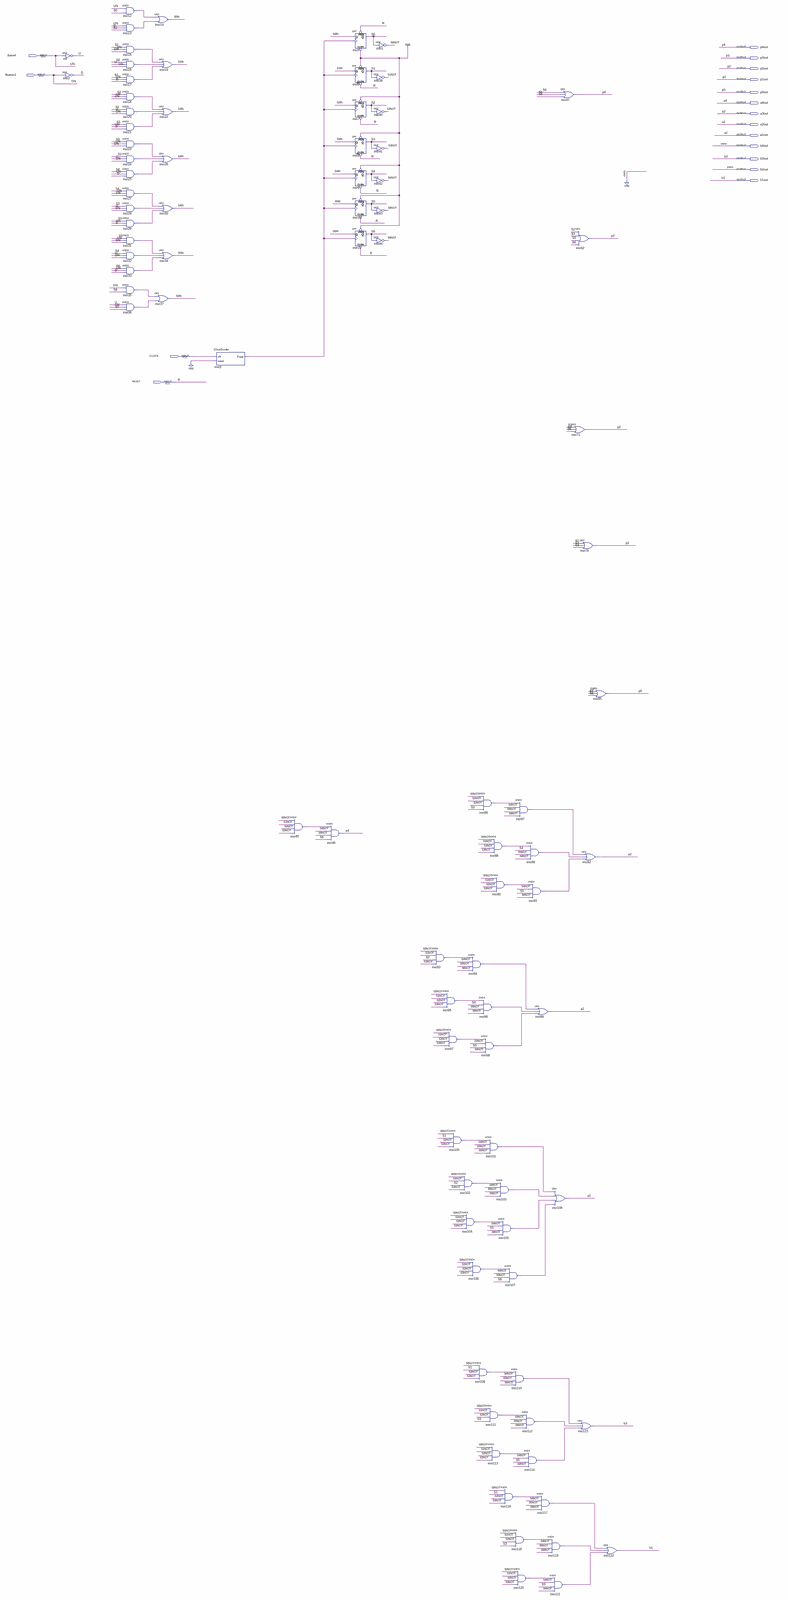
[diagram p0: schematic sheet, whole]
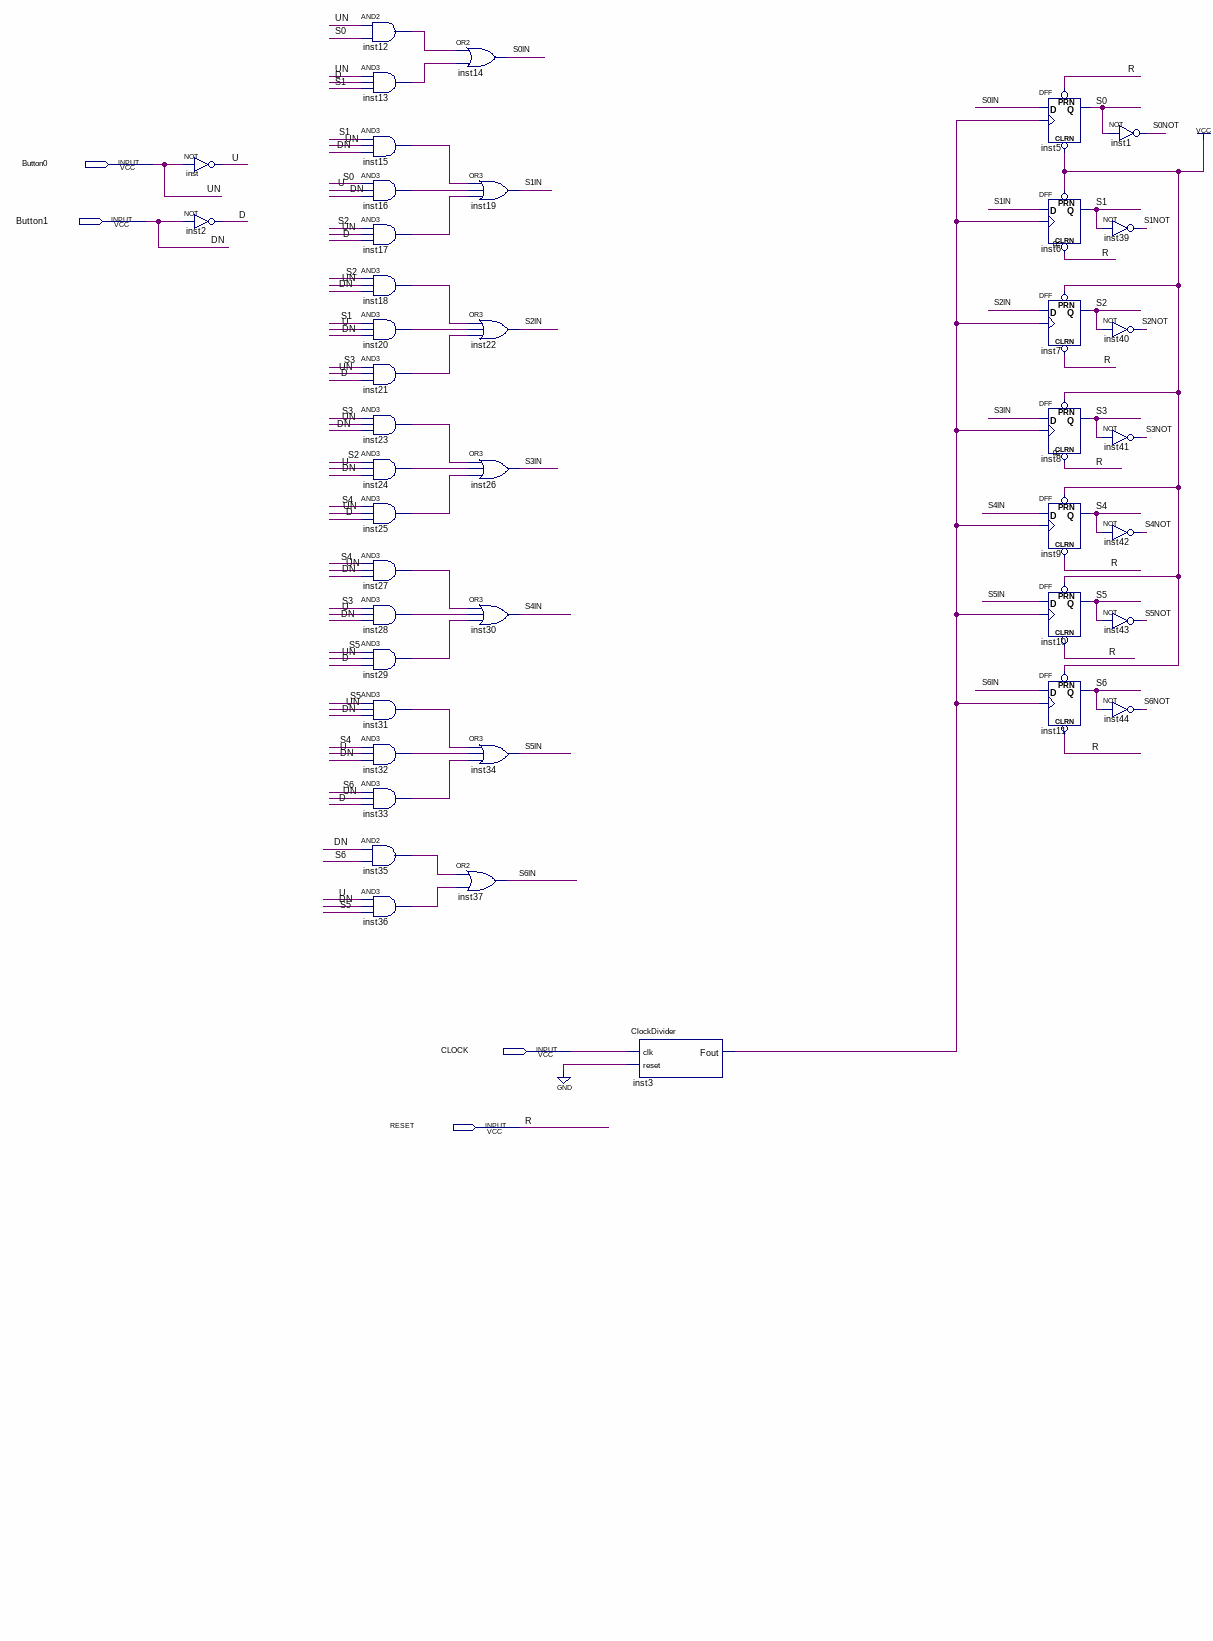
[diagram p1: schematic sheet, upper left part]
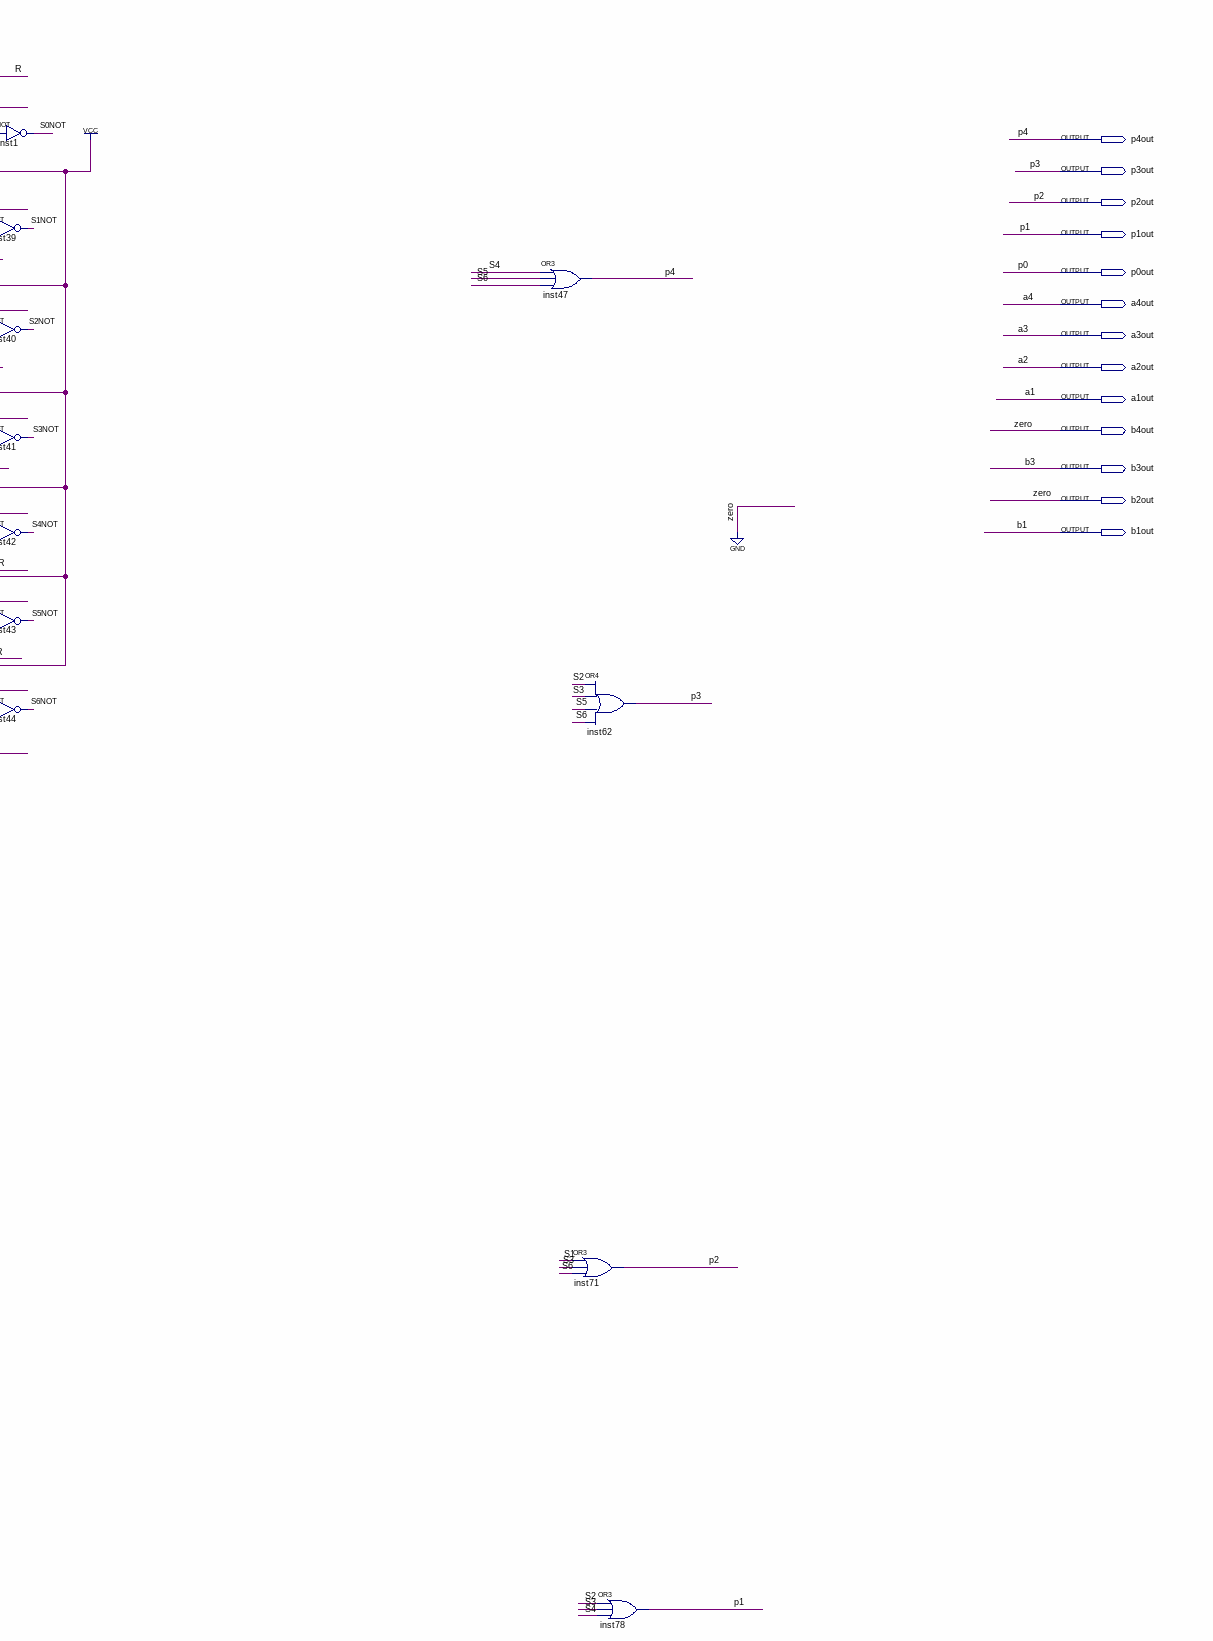
[diagram p2: schematic sheet, upper right part]
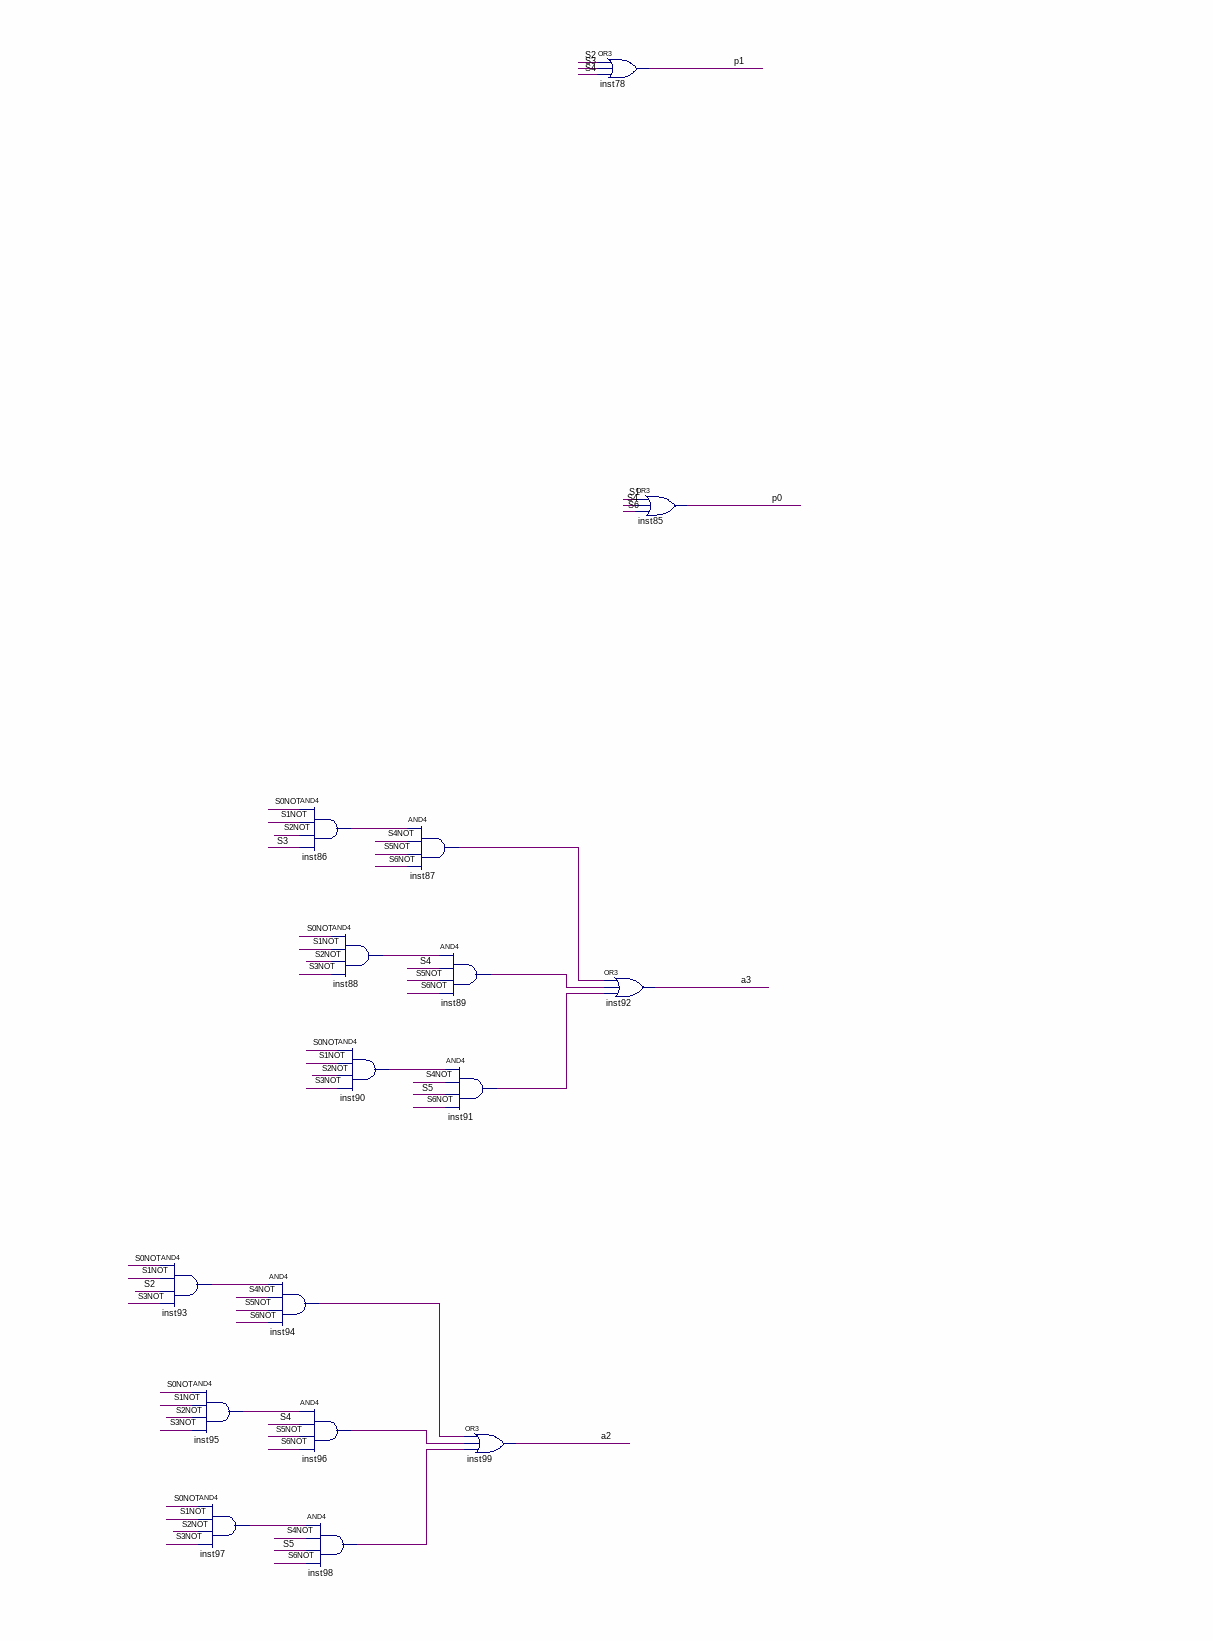
[diagram p3: schematic sheet, middle right part]
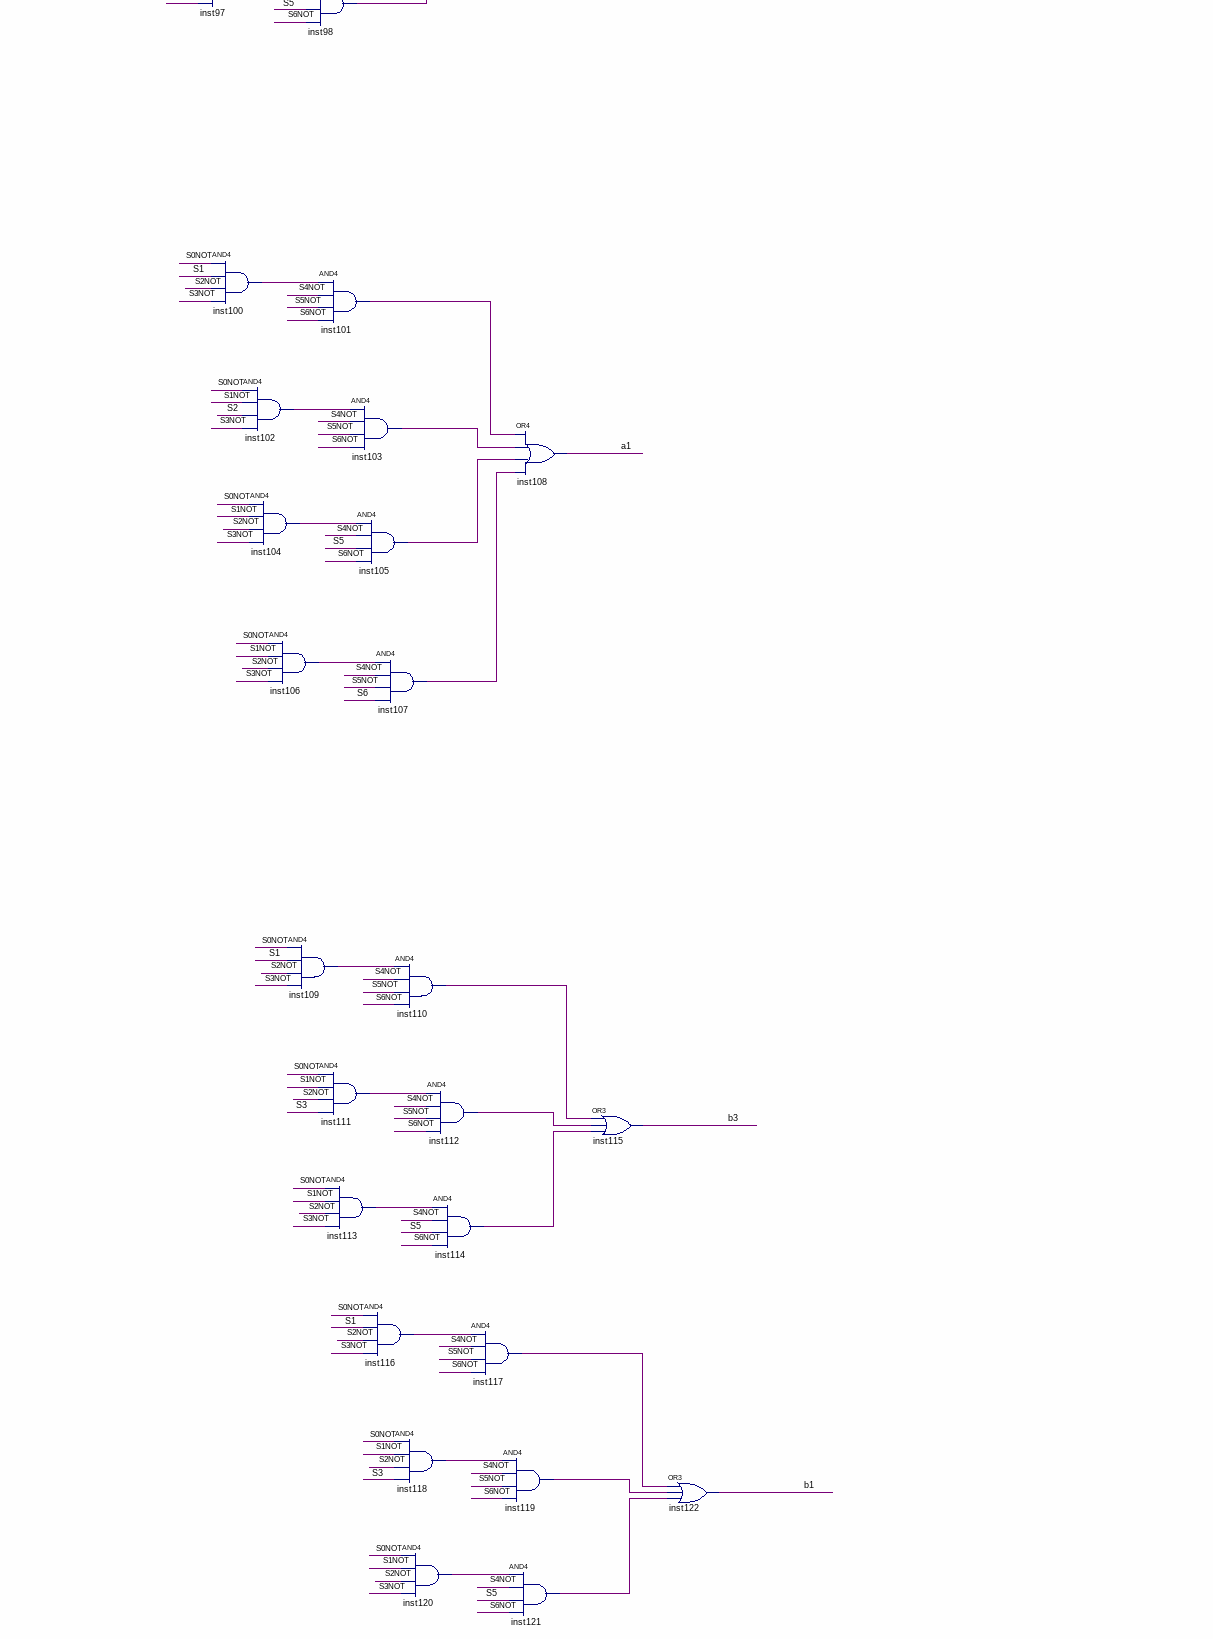
[diagram p4: schematic sheet, lower right part]
// Quartus schematic Lab_6_OHE.bdf as structural Verilog: 87 symbols, 17 pins
module Lab_6_OHE (
  input  Button0,
  input  Button1,
  input  CLOCK,
  input  RESET,
  output p4out,
  output p3out,
  output p2out,
  output p1out,
  output p0out,
  output a4out,
  output a3out,
  output a2out,
  output a1out,
  output b4out,
  output b3out,
  output b2out,
  output b1out
);

  wire D, inst3_fout, inst12_out, inst13_out, inst15_out, inst16_out, inst17_out, inst18_out, inst20_out,
       inst21_out, inst23_out, inst24_out, inst25_out, inst27_out, inst28_out, inst29_out, inst31_out,
       inst32_out, inst33_out, inst35_out, inst36_out, inst45_out, inst86_out, inst87_out, inst88_out,
       inst89_out, inst90_out, inst91_out, inst93_out, inst94_out, inst95_out, inst96_out, inst97_out,
       inst98_out, inst100_out, inst101_out, inst102_out, inst103_out, inst104_out, inst105_out, inst106_out,
       inst107_out, inst109_out, inst110_out, inst111_out, inst112_out, inst113_out, inst114_out,
       inst116_out, inst117_out, inst118_out, inst119_out, inst120_out, inst121_out, S0, S0IN, S0NOT, S1,
       S1IN, S1NOT, S2, S2IN, S2NOT, S3, S3IN, S3NOT, S4, S4IN, S4NOT, S5, S5IN, S5NOT, S6, S6IN, S6NOT, U;

  not inst (U, Button0);
  not inst2 (D, Button1);
  and inst12 (inst12_out, Button0, S0);
  and inst13 (inst13_out, Button0, D, S1);
  and inst15 (inst15_out, S1, Button0, Button1);
  and inst16 (inst16_out, S0, U, Button1);
  and inst17 (inst17_out, S2, Button0, D);
  and inst18 (inst18_out, S2, Button0, Button1);
  and inst20 (inst20_out, S1, U, Button1);
  and inst21 (inst21_out, S3, Button0, D);
  and inst23 (inst23_out, S3, Button0, Button1);
  and inst24 (inst24_out, S2, U, Button1);
  and inst25 (inst25_out, S4, Button0, D);
  and inst27 (inst27_out, S4, Button0, Button1);
  and inst28 (inst28_out, S3, U, Button1);
  and inst29 (inst29_out, S5, Button0, D);
  and inst31 (inst31_out, S5, Button0, Button1);
  and inst32 (inst32_out, S4, U, Button1);
  and inst33 (inst33_out, S6, Button0, D);
  and inst35 (inst35_out, Button1, S6);
  and inst36 (inst36_out, U, Button1, S5);
  or inst14 (S0IN, inst12_out, inst13_out);
  or inst19 (S1IN, inst15_out, inst16_out, inst17_out);
  or inst22 (S2IN, inst18_out, inst20_out, inst21_out);
  or inst26 (S3IN, inst23_out, inst24_out, inst25_out);
  or inst30 (S4IN, inst27_out, inst28_out, inst29_out);
  or inst34 (S5IN, inst31_out, inst32_out, inst33_out);
  or inst37 (S6IN, inst35_out, inst36_out);
  ClockDivider inst3 (.clk(CLOCK), .reset(1'b0), .Fout(inst3_fout));
  and inst45 (inst45_out, S0NOT, S1NOT, S2NOT, S3NOT);
  and inst46 (a4out, inst45_out, S4NOT, S5NOT, S6);
  DFF inst5 (.CLRN(1'b1), .CLK(inst3_fout), .D(S0IN), .PRN(RESET), .Q(S0));
  DFF inst6 (.CLRN(RESET), .CLK(inst3_fout), .D(S1IN), .PRN(1'b1), .Q(S1));
  DFF inst7 (.CLRN(RESET), .CLK(inst3_fout), .D(S2IN), .PRN(1'b1), .Q(S2));
  DFF inst8 (.CLRN(RESET), .CLK(inst3_fout), .D(S3IN), .PRN(1'b1), .Q(S3));
  DFF inst9 (.CLRN(RESET), .CLK(inst3_fout), .D(S4IN), .PRN(1'b1), .Q(S4));
  DFF inst10 (.CLRN(RESET), .CLK(inst3_fout), .D(S5IN), .PRN(1'b1), .Q(S5));
  DFF inst11 (.CLRN(RESET), .CLK(inst3_fout), .D(S6IN), .PRN(1'b1), .Q(S6));
  not inst1 (S0NOT, S0);
  not inst39 (S1NOT, S1);
  not inst40 (S2NOT, S2);
  not inst41 (S3NOT, S3);
  not inst42 (S4NOT, S4);
  not inst43 (S5NOT, S5);
  not inst44 (S6NOT, S6);
  and inst93 (inst93_out, S0NOT, S1NOT, S2, S3NOT);
  and inst95 (inst95_out, S0NOT, S1NOT, S2NOT, S3NOT);
  and inst97 (inst97_out, S0NOT, S1NOT, S2NOT, S3NOT);
  and inst100 (inst100_out, S0NOT, S1, S2NOT, S3NOT);
  and inst94 (inst94_out, inst93_out, S4NOT, S5NOT, S6NOT);
  and inst102 (inst102_out, S0NOT, S1NOT, S2, S3NOT);
  and inst104 (inst104_out, S0NOT, S1NOT, S2NOT, S3NOT);
  and inst106 (inst106_out, S0NOT, S1NOT, S2NOT, S3NOT);
  and inst86 (inst86_out, S0NOT, S1NOT, S2NOT, S3);
  and inst96 (inst96_out, inst95_out, S4, S5NOT, S6NOT);
  and inst98 (inst98_out, inst97_out, S4NOT, S5, S6NOT);
  and inst101 (inst101_out, inst100_out, S4NOT, S5NOT, S6NOT);
  and inst109 (inst109_out, S0NOT, S1, S2NOT, S3NOT);
  and inst111 (inst111_out, S0NOT, S1NOT, S2NOT, S3);
  and inst113 (inst113_out, S0NOT, S1NOT, S2NOT, S3NOT);
  and inst88 (inst88_out, S0NOT, S1NOT, S2NOT, S3NOT);
  and inst90 (inst90_out, S0NOT, S1NOT, S2NOT, S3NOT);
  and inst103 (inst103_out, inst102_out, S4NOT, S5NOT, S6NOT);
  and inst105 (inst105_out, inst104_out, S4NOT, S5, S6NOT);
  and inst107 (inst107_out, inst106_out, S4NOT, S5NOT, S6);
  and inst116 (inst116_out, S0NOT, S1, S2NOT, S3NOT);
  and inst87 (inst87_out, inst86_out, S4NOT, S5NOT, S6NOT);
  and inst110 (inst110_out, inst109_out, S4NOT, S5NOT, S6NOT);
  and inst112 (inst112_out, inst111_out, S4NOT, S5NOT, S6NOT);
  and inst118 (inst118_out, S0NOT, S1NOT, S2NOT, S3);
  and inst120 (inst120_out, S0NOT, S1NOT, S2NOT, S3NOT);
  and inst89 (inst89_out, inst88_out, S4, S5NOT, S6NOT);
  and inst91 (inst91_out, inst90_out, S4NOT, S5, S6NOT);
  or inst99 (a2out, inst94_out, inst96_out, inst98_out);
  and inst114 (inst114_out, inst113_out, S4NOT, S5, S6NOT);
  and inst117 (inst117_out, inst116_out, S4NOT, S5NOT, S6NOT);
  or inst108 (a1out, inst101_out, inst103_out, inst105_out, inst107_out);
  and inst119 (inst119_out, inst118_out, S4NOT, S5NOT, S6NOT);
  and inst121 (inst121_out, inst120_out, S4NOT, S5, S6NOT);
  or inst47 (p4out, S4, S5, S6);
  or inst71 (p2out, S1, S3, S6);
  or inst62 (p3out, S2, S3, S5, S6);
  or inst78 (p1out, S2, S3, S4);
  or inst92 (a3out, inst87_out, inst89_out, inst91_out);
  or inst115 (b3out, inst110_out, inst112_out, inst114_out);
  or inst85 (p0out, S1, S4, S6);
  or inst122 (b1out, inst117_out, inst119_out, inst121_out);

  assign b2out = 1'b0;
  assign b4out = 1'b0;

  // Other names for the same wires on the sheet: a1 = a1out; a2 = a2out; a3 = a3out; a4 = a4out; b1 = b1out;
  //   b3 = b3out; UN = Button0; DN = Button1; p0 = p0out; p1 = p1out; p2 = p2out; p3 = p3out; p4 = p4out; R = RESET
endmodule
